# Altium schematic sheet LTE_power_Rev01.SchDoc
size Letter; SheetNumber: 4; SheetTotal: 6
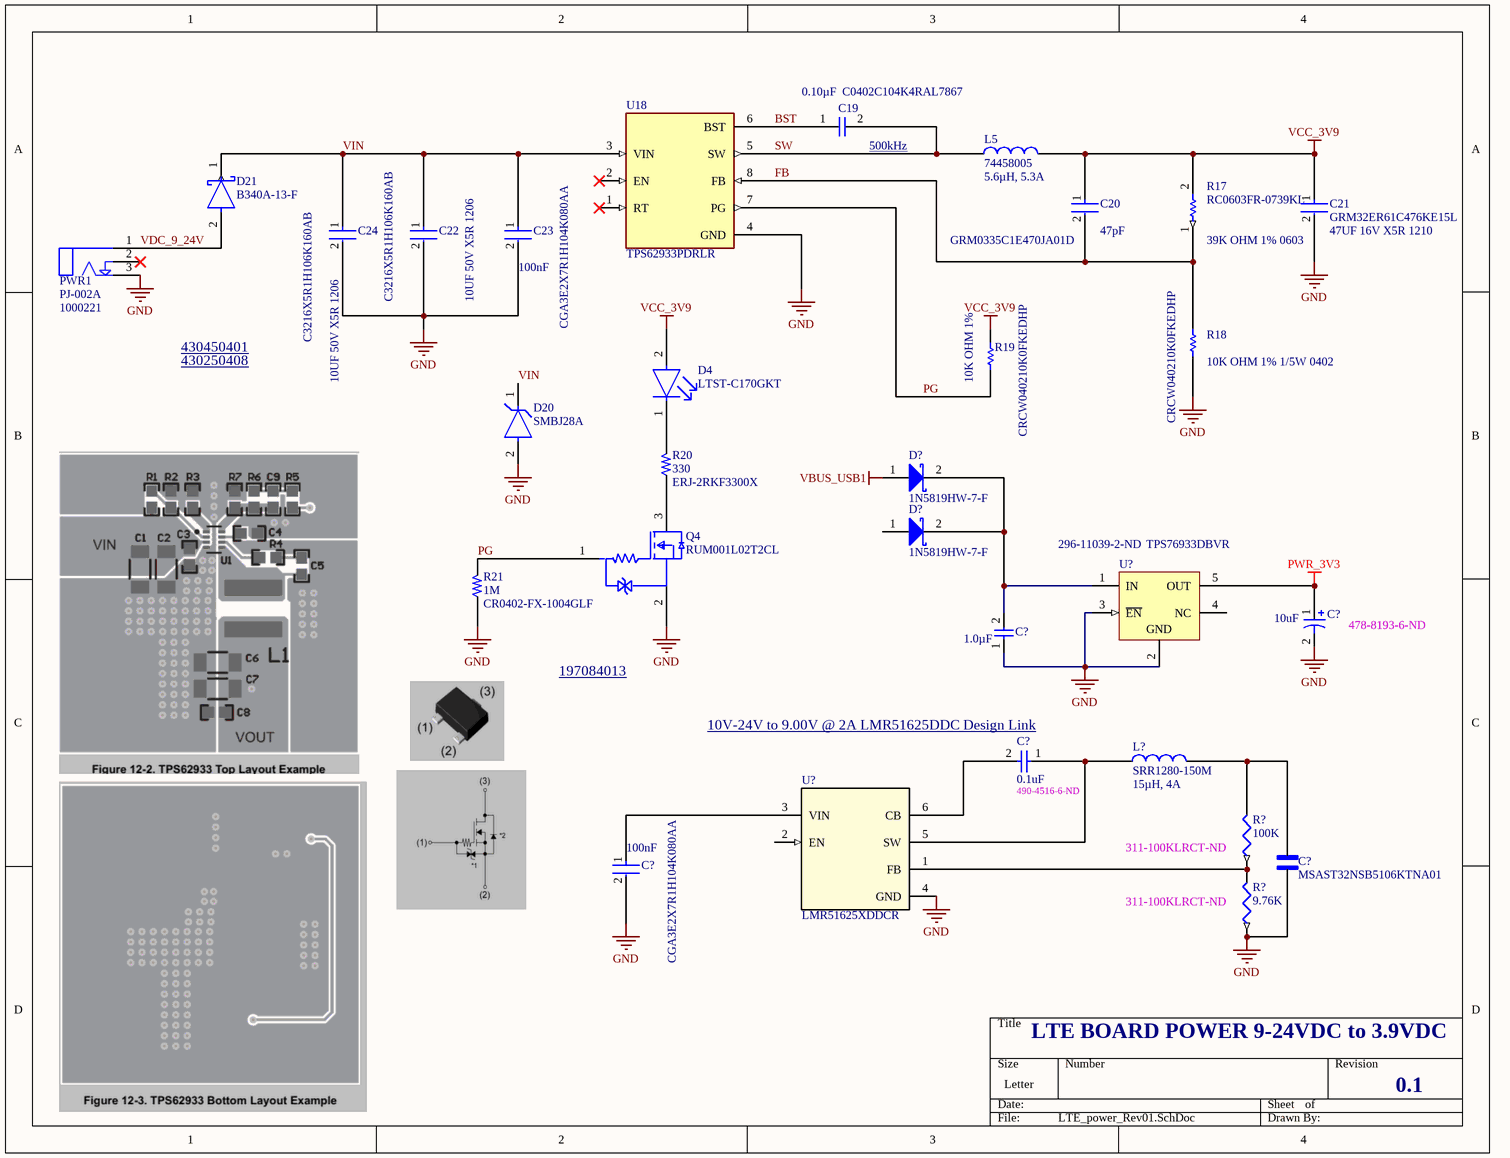
[diagram p0: LTE_power_Rev01.SchDoc]

## Parts
(Parts that share a designator on the sheet are numbered #1, #2 ... from top to bottom, then left to right.)
C19  C0402C104K4RAL7867  Capacitance: 0.10µF  [SMD CAP 1005]
C20  GRM0335C1E470JA01D  Capacitance: 47pF  [FP-GRM033-0_03-IPC_B]
C21  GRM32ER61C476KE15L  Capacitance: 47UF 16V X5R 1210  [FP-GRM32E-0_3-0_2-IPC_C]
C22  C3216X5R1H106K160AB  Capacitance: 10UF 50V X5R 1206  [FP-C3216-160-0_2-IPC_A]
C23  CGA3E2X7R1H104K080AA  Capacitance: 100nF  [FP-CGA3E-0_3-0_1-IPC_A]
C24  C3216X5R1H106K160AB  Capacitance: 10UF 50V X5R 1206  [FP-C3216-160-0_2-IPC_A]
C?#1  value 10uF  Supplier Part Number 2: 478-8193-6-ND  [TC3216-1206]  (hidden comment: F931A106MAA)
C?#2  value 1.0µF  [SMD CAP 1005]  (hidden comment: GRM155R61A105KE15D)
C?#3  Capacitance: 0.1uF  Supplier Part Number 1: 490-4516-6-ND  [SMD CAP 1005]  (hidden comment: GRM155R71H103KA88D)
C?#4  CGA3E2X7R1H104K080AA  Capacitance: 100nF  [FP-CGA3E-0_3-0_1-IPC_A]
C?#5  MSAST32NSB5106KTNA01  [CAPC3225X210N]
D4  LTST-C170GKT  [FP-LTST-C170GKT-MFG]
D20  SMBJ28A  [FP-SMBJ-MFG]
D21  B340A-13-F  [FP-SMA-MFG]
D?#1  1N5819HW-7-F  [DIOD-SOD-123-2_V]
D?#2  1N5819HW-7-F  [DIOD-SOD-123-2_V]
L5  5.6µH, 5.3A  [WE-PD4_Type X]
L?  value 15µH, 4A  [IND_BOURNS_SRR1280]  (hidden comment: SRR1280-150M)
PWR1  Manufacturer_Part_Number1: PJ-002A  Part_Number: 1000221  [PJ-202AH]  (hidden comment: PJ-202A)
Q4  RUM001L02T2CL  [FP-VMT3-MFG]
R17  RC0603FR-0739KL  Resistance: 39K OHM 1% 0603  [RESC1608X55X25LL10T15]
R18  CRCW040210K0FKEDHP  Resistance: 10K OHM 1% 1/5W 0402  [RESC1005X40X25ML05T10]
R19  CRCW040210K0FKEDHP  Resistance: 10K OHM 1%  [RESC1005X40X25ML05T10]
R20  Resistance: 330  [SMD RES 1005]  (hidden comment: ERJ-2RKF3300X)
R21  Resistance: 1M  [SMD RES 1005]  (hidden comment: CR0402-FX-1004GLF)
R?#1  value 100K  Supplier Part Number 1: 311-100KLRCT-ND  [SMD RES 1005]  (hidden comment: RC0402FR-07100KL)
R?#2  value 9.76K  Supplier Part Number 1: 311-100KLRCT-ND  [SMD RES 1005]  (hidden comment: RMCF0402FT9K76)
U18  TPS62933PDRLR  [SOFL50P160X60-8N]
U?#1  TPS76933DBVR  Supplier Part Number 1: 296-11039-2-ND  [DBV0005A_L]
U?#2  LMR51625XDDCR  [DDC0006A-MFG]

## Nets
GND: C21.2 C22.2 C23.2 C24.2 C?#1.2 C?#2.1 C?#4.2 C?#5.1 D20.2(A) PWR1.3 Q4.2(Source) R18.1 R21.1 R?#2.1 U18.4(GND) U?#1.2(GND) U?#1.3(~{EN}) U?#2.4(GND)
PWR_3V3: C?#1.1 U?#1.5(OUT)
VBUS_USB1: D?#1.1(A)
VCC_3V9: C20.1 C21.1 D4.2(A) L5.2 R17.2 R19.2
BST: C19.1 U18.6(BST)
FB: C20.2 R17.1 R18.2 U18.8(FB)
PG: Q4.1(Gate) R19.1 R21.2 U18.7(PG)
SW: C19.2 L5.1 U18.5(SW)
VDC_9_24V: D21.2(A) PWR1.1
VIN: C22.1 C23.1 C24.1 D20.1(C) D21.1(C) U18.3(VIN)
NetC?#2_2: C?#2.2 D?#1.2(K) D?#2.2(K) U?#1.1(IN)
NetC?#3_1: C?#3.1 L?.1 U?#2.5(SW)
NetC?#3_2: C?#3.2 U?#2.6(CB)
NetC?#4_1: C?#4.1 U?#2.3(VIN)
NetC?#5_2: C?#5.2 L?.2 R?#1.2
NetD4_1: D4.1(C) R20.2
NetQ4_3: Q4.3(Drain) R20.1
NetR?#1_1: R?#1.1 R?#2.2 U?#2.1(FB)

Not connected (* = marked no-connect by the designer): D?#2 1(A); PWR1 2*; U18 1(RT)* 2(EN)*; U?#1 4(NC); U?#2 2(EN)

## Notes on the sheet
- (near C19) 500kHz <https://www.mouser.com/ProductDetail/Molex/43030-0003-Cut-Strip?qs=Dbnw6jgPYP7YvqIV9njgyg%3D%3D>
- 9.3.3 Voltage Reference
  The internal reference voltage, VREF, is designed at 0.8 V (typical). The negative feedback system of converterproduces a precise ±2% feedback voltage, VFB, over full temperature by scaling the output of a temperaturestable internal band-gap circuit.
- (near U18) 9.3.8 Power Good
  The TPS62933P and TPS62933O have a built-in power good (PG) function to indicate whether the outputvoltage has reached its appropriate level or not. The PG signal can be used for start-up sequencing ofmultiple rails. The PG pin is an open-drain output that requires a pullup resistor to any voltage below 5.5 V.TI recommends a pullup resistor of 10 kΩ – 100 kΩ. The device can sink approximately 4 mA of current andmaintain its specified logic low level. After the FB pin voltage is between 90% and 110% of the internal referencevoltage (VREF) and after a deglitch time of 70 μs, the PG turns to high impedance status. The PG pin is pulledlow after a deglitch time of 18 μs when FB pin voltage is lower than 85% of the internal reference voltage orgreater than 115% of the internal reference voltage, or in events of thermal shutdown, EN shutdown, or UVLOconditions. VIN must remain present for the PG pin to stay low
- (near U18) 9.3.6 Enable and Adjusting Undervoltage Lockout
  The EN pin provides electrical ON and OFF control of the device. When the EN pin voltage exceeds the enablethreshold voltage, VEN_RISE, the TPS6293x begins operation. If the EN pin voltage is pulled below the disablethreshold voltage, VEN_FALL, the converter stops switching and enters shutdown mode.
  The EN pin has an internal pullup current source, which allows the user to float the EN pin to enable the device.If an application requires control of the EN pin, use an open-drain or open-collector or GPIO output logic tointerface with the pin
- (near L5) 9.3.4 Output Voltage Setting
  A precision 0.8-V reference voltage, VREF, is used to maintain a tightly regulated output voltage over the entireoperating temperature range. The output voltage is set by a resistor divider from the output voltage to the FBpin. TI recommends using 1% tolerance resistors with a low temperature coefficient for the FB divider. Select thebottom-side resistor, RFBB, for the desired divider current and use Equation 1 to calculate the top-side resistor,RFBT. Lower RFBB increases the divider current and reduces efficiency at very light load. Larger RFBB makes theFB voltage more susceptible to noise, so larger RFBB values require a more carefully designed feedback path onthe PCB. Setting RFBB = 10 kΩ and RFBT in the range of 10 kΩ to 300 kΩ is recommended for most applications.The tolerance and temperature variation of the resistor dividers affect the output voltage regulation
- (near C21) Skywire modems have a recommended input voltage of 3.90V. This recommendedinput voltage is chosen as the optimal input voltage to maximize power efficiency of themodem’s internal power systems. While the modems do support a fairly wide inputvoltage range, it is recommended to power the modems off of 3.90V as any deviationsoutside of the modem’s acceptable operating voltage range may irreparably damage themodem and void the warranty
- 430450401 <https://www.molex.com/molex/products/part-detail/pcb_headers/0430450401>
- 430250408 <https://www.molex.com/molex/products/part-detail/crimp_housings/0430250408>
- (near U18) The switching frequency can be set by the configuration of the RT pin in the range of 200 kHz to 2.2 MHz, whichallows for efficiency and solution size optimization when selecting the output filter components. The TPS62932,TPS62933, TPS62933P, and TPS62933O also have a frequency spread spectrum feature, which helps withlowering down EMI noise.
- (near U18) 9.3.5 Switching Frequency Selection
  The switching frequency is set by the condition of the RT input. The condition of this input is detected when thedevice is first enabled. Once the converter is running, the switching frequency selection is fixed and cannot bechanged until the next power-on cycle or EN toggle. Table 9-1 shows the selection programming. In adjustablefrequency mode, the switching frequency can be set between 200 kHz and 2200 kHz by proper selection of RTresistor.
  Floating > 280 kΩ 500 kHz
- 9.3.8 Power Good
  The TPS62933P and TPS62933O have a built-in power good (PG) function to indicate whether the outputvoltage has reached its appropriate level or not. The PG signal can be used for start-up sequencing ofmultiple rails. The PG pin is an open-drain output that requires a pullup resistor to any voltage below 5.5 V.TI recommends a pullup resistor of 10 kΩ – 100 kΩ. The device can sink approximately 4 mA of current andmaintain its specified logic low level. After the FB pin voltage is between 90% and 110% of the internal referencevoltage (VREF) and after a deglitch time of 70 μs, the PG turns to high impedance status. The PG pin is pulledlow after a deglitch time of 18 μs when FB pin voltage is lower than 85% of the internal reference voltage orgreater than 115% of the internal reference voltage, or in events of thermal shutdown, EN shutdown, or UVLOconditions. VIN must remain present for the PG pin to stay low.
- TPS62933P and TPS62933O open-drain power good indicator, which is asserted low ifoutput voltage is out of PG threshold, overvoltage, or if the device is under thermalshutdown, EN shutdown, or during soft start.
- 197084013 <https://www.molex.com/molex/products/part-detail/quick_disconnects/0197084013>
- (near C?#3) 10V-24V to 9.00V @ 2A LMR51625DDC Design Link <https://webench.ti.com/power-designer/switching-regulator/export/12>
- LTE BOARD POWER 9-24VDC to 3.9VDC
- 0.1

## Library data of the parts
C19 = 1000742: 0.1 µF ±10% 16V Ceramic Capacitor X7R 0402 (1005 Metric); Manufacturer1: Kemet; Manufacturer_Part_Number1: C0402C104K4RALTU; Item_Phase: Production; Mounting_Type: Surface Mount; Operating_Temperature: -55°C ~ 125°C; Thickness_Max: 0.022" (0.55mm); Value: 0.1uF; Tolerance: ±10%; Applications: General Purpose; Population: *; Part_Number: 1000742; Part_Type: Capacitor; Revision: A; Distributor1: Digi-Key; Distributor_Part_Number1: 399-6342-1-ND; Specs_View: https://app.bom.com/a/YGZ57I1I1KJQDBOE?v=spec.summary; Bom_View: https://app.bom.com/a/YGZ57I1I1KJQDBOE?v=bom.indented; Sourcing_View: https://app.bom.com/a/YGZ57I1I1KJQDBOE?v=sourcing.relationships; Costing_View: https://app.bom.com/a/YGZ57I1I1KJQDBOE?v=costing.summary; Files_View: https://app.bom.com/a/YGZ57I1I1KJQDBOE?v=files.associations; Datasheet_Link: http://www.samsungsem.com/kr/support/product-search/mlcc/CL05B104KO5NNNC.jsp; Capacitor_Type: Ceramic; Package_Case: 0402 (1005 Metric); Size_Dimension: 0.039" L x 0.020" W (1.00mm x 0.50mm); Temperature_Coefficient: X7R; Voltage_Rating: 16V; Distributor2: Digi-Key; Distributor_Part_Number2: 1276-1001-1-ND; Manufacturer2: Samsung Electro-Mechanics America, Inc; Manufacturer_Part_Number2: CL05B104KO5NNNC; Digi-Key Part Number: 399-C0402C104K4RAL7867CT-ND; Manufacturer: KEMET; Manufacturer Product Number: C0402C104K4RAL7867
C20 = CMP-2010-00985-2: 47 pF ±5% 25V Ceramic Capacitor C0G, NP0 0201 (0603 Metric); Manufacturer: Murata Electronics; Tolerance: 5%; Case Code (Imperial): 0201; Mount: Surface Mount; Voltage Rating: 25V; Depth: 0.3mm; Termination: SMD/SMT; Length: 0.024inch; Lead Free: Lead Free; Thickness: 0.013inch; Dielectric: C0G; Voltage Rating (DC): 25V; Case Code (Metric): 0603; Case/Package: 0201; Max Operating Temperature: 125°C; REACH SVHC: No SVHC; Package Quantity: 15000; Min Operating Temperature: -55°C; Packaging: Tape and Reel; Width: 0.012inch; Digi-Key Part Number: 490-1256-1-ND; Manufacturer Product Number: GRM0335C1E470JA01D
C21 = CMP-2000-06362-2: 47 µF ±10% 16V Ceramic Capacitor X5R 1210 (3225 Metric); Manufacturer: Murata Electronics; Case Code (Metric): 3225; RoHS Compliant: Yes; Min Operating Temperature: -55°C; Radiation Hardening: No; Voltage: 16V; Package Quantity: 1; Case Code (Imperial): 1210; Tolerance: 10%; REACH SVHC: No SVHC; Voltage Rating (DC): 16V; Dielectric: X5R; Case/Package: 1210; Length: 3.2mm; Voltage Rating: 16V; Packaging: Cut Tape; Width: 0.098inch; Number of Pins: 2; Lead Free: Lead Free; Height: 2.5mm; Material: Ceramic; Mount: Surface Mount; Termination: SMD/SMT; Max Operating Temperature: 85°C; Thickness: 0.106inch; Depth: 2.5mm; Digi-Key Part Number: 490-6539-1-ND; Manufacturer Product Number: GRM32ER61C476KE15L
C22 C24 = CMP-2000-06045-2: 10 µF ±10% 50V Ceramic Capacitor X5R 1206 (3216 Metric); Manufacturer: TDK Corporation; Min Operating Temperature: -55°C; Weight: 0.000571oz; Tolerance: 10%; Lead Free: Lead Free; REACH SVHC: No SVHC; Dielectric Material: Ceramic; Termination: SMD/SMT; Radiation Hardening: No; Case Code (Metric): 3216; Max Operating Temperature: 85°C; Voltage Rating (DC): 50V; Packaging: Tape and Reel; Height: 1.6mm; Voltage: 50V; Dielectric: X5R; Mount: Surface Mount; Voltage Rating: 50V; Length: 3.2mm; RoHS Compliant: Yes; Thickness: 0.071inch; Depth: 1.6mm; Width: 0.063inch; Case/Package: 1206; Series: C; Package Quantity: 1; Resistor Type: Ceramic; Case Code (Imperial): 1206; Construction: Flat; Digi-Key Part Number: 445-5998-1-ND; Manufacturer Product Number: C3216X5R1H106K160AB
C23 C?#4 = CMP-2000-07546-2: 0.1 µF ±10% 50V Ceramic Capacitor X7R 0603 (1608 Metric); Manufacturer: TDK Corporation; Weight: 7.1E-05oz; Composition: Ceramic; Max Operating Temperature: 125°C; Termination: SMD/SMT; Dielectric: X7R; Length: 1.6mm; Package Quantity: 1; REACH SVHC: No SVHC; Lead Free: Lead Free; Case Code (Metric): 1608; Min Operating Temperature: -55°C; Packaging: Tape and Reel; Tolerance: 10%; Voltage Rating: 50V; Case Code (Imperial): 0603; Case/Package: 0603; Voltage Rating (DC): 50V; Depth: 0.8mm; Radiation Hardening: No; Ratings: AEC-Q200; Mount: Surface Mount; Voltage: 50V; Thickness: 0.035inch; Width: 0.8mm; Height: 0.8mm; Digi-Key Part Number: 445-5666-1-ND; Manufacturer Product Number: CGA3E2X7R1H104K080AA
C?#1 = Cap Pol1: CAP TANT 10UF 10V 20% 1206; Manufacturer: AVX Corporation; Published: 8-Jun-2000; LatestRevisionDate: 17-Jul-2002; LatestRevisionNote: Re-released for DXP Platform.; PackageReference: RB7.6-15; Publisher: Altium Limited; PackageDescription: Polarized Capacitor (Radial); 2 Leads; Footprint: 1206 (3216 Metric); Digi-Key Part Number: 478-8193-1-ND; Manufacturer Part Number: F931A106MAA; Cost: 0.09660; Supplier 1: Mouser; Supplier 2: Digi-Key
C?#2 = C0603-1µ0: CAP CER 1UF 10V 10% X5R 0402; Manufacturer: Murata Electronics North America; Artikkelnr Noca: 20039205; Part Number: C0603-1µ0; Manufacturer Part Number: GRM155R61A105KE15D; Datasheet: *; Footprint: 0603; LatestRevisionDate: 2009-11-23; Pin Count: 2; Publisher: Nordic Semiconductor; Published: 2009-05-08; Supplier: *; Supplier part number: *; 2nd source Supplier: *; 2nd source part number: *; Digi-Key Part Number: 490-3890-1-ND; Note: *
C?#3 = Cap Semi: 0.1 µF ±10% 16V Ceramic Capacitor X7R 0402 (1005 Metric); Manufacturer: Murata Electronics; Manufacturer Product Number: GRM155R71C104KA88D; PackageReference: 0402; PackageDescription: Chip Capacitor; Digi-Key Part Number: 490-3261-1-ND; Footprint: 0402 (1005 Metric); Cost: 0.02558; Supplier 1: Digi-Key
C?#5 = MSAST32NSB5106KTNA01: MF: {'manufacturer': u'Taiyo Yuden'}; Package: None; Price: None; Value: *; MP: MSAST32NSB5106KTNA01; Availability: Unavailable
D4 = CMP-1674-00002-6: Green 569nm LED Indication - Discrete 2.1V 0805 (2012 Metric); Manufacturer: Lite-On Inc.; Lens Style: Diffused; Number of Elements: 1; Wavelength: 565nm; Luminous Intensity: 6mcd; Test Current: 10mA; Power Dissipation: 100mW; Reverse Voltage: 5V; Forward Current: 30mA; Lens Transparency: Clear; Viewing Angle: 130°; Lens Color: Colorless; Min Operating Temperature: -55°C; Dominant Wavelength: 569nm; Number of Pins: 2; Max Operating Temperature: 85°C; Forward Voltage: 2.1V; Color: Green; Radiation Hardening: No; Illumination Color: Green; Case Code (Metric): 2012; Case/Package: 0805; Width: 1.25mm; Case Code (Imperial): 0805; Package Quantity: 1; Height: 1.1mm; Depth: 1.25mm; Length: 2mm; Power Rating: 100mW; Lead Free: Lead Free; Number of LEDs: 1; Packaging: Tape and Reel; Mount: Surface Mount; Voltage: 5V; Digi-Key Part Number: 160-1179-1-ND; Manufacturer Product Number: LTST-C170GKT; Value: LED
D20 = CMP-08607-000081-1: 45.4V Clamp 13.3A Ipp Tvs Diode Surface Mount DO-214AA (SMBJ); Manufacturer: Littelfuse Inc.; Breakdown Voltage: 31.1V; Reverse Standoff Voltage: 28V; Direction: Unidirectional; Number Of Channels: 1; Peak Pulse Power: 600W; Max Junction Temp: +150°C; Value: TVS Voltage - Reverse Standoff (Typ) 28V  Voltage - Breakdown (Min) 31V; Temperature: -65°C to +150°C; Category: Diode; RoHS: TRUE; Height: 2.61mm; Device Class L1: Circuit Protection; Temperature Range Low: -65°C; ComponentLink2Description: Datasheet; Digikey Description: TVS DIODE 28V 45.4V DO214AA; Automotive: No; Package: SMBJ; Mouser Description: Littelfuse SMBJ28A, Uni-Directional TVS Diode, 600W, 2-Pin DO-214AA; ComponentLink2URL: https://www.littelfuse.com/~/media/electronics/datasheets/tvs_diodes/littelfuse_tvs_diode_smbj_datasheet.pdf.pdf; Manufacturer Part Number: SMBJ28A; Octopart: https://octopart.com/smbj28a-littelfuse-350790; Clamping Voltage: 45.4V; Peak Pulse Current: 13.3A; Temperature Range High: +150°C; Device Class L3: unset; Device Class L2: TVS Diodes; Lead Free: Yes; Digi-Key Part Number: SMBJ28ALFCT-ND; Manufacturer Product Number: SMBJ28A
D21 = CMP-1667-00003-3: Diode 40 V 3A Surface Mount SMA; Max Forward Surge Current (Ifsm): 80A; Voltage: 40V; Forward Voltage: 500mV; Polarity: Standard; Max Reverse Current: 500uA; Capacitance: 250pF; Element Configuration: Single; Mount: Surface Mount; Output Current: 3A; Radiation Hardening: No; Width: 2.92mm; Current Rating: 3A; Termination: SMD/SMT; Series: -; Max Operating Temperature: 125°C; Current: 3A; Max Repetitive Reverse Voltage (Vrrm): 40V; Min Operating Temperature: -55°C; REACH SVHC: No SVHC; Number of Pins: 2; Average Rectified Current: 3A; Contact Plating: Tin; RoHS Compliant: Yes; Max Reverse Voltage (DC): 40V; Packaging: Tape and Reel; Height: 2.3mm; Length: 4.6mm; Case/Package: SMA; Weight: 0.002258oz; Peak Non-Repetitive Surge Current: 80A; Package Quantity: 5000; Lead Free: Lead Free; Forward Current: 3A; Voltage Rating (DC): 40V; Digi-Key Part Number: B340A-FDICT-ND; Manufacturer Product Number: B340A-13-F
D?#1 D?#2 = CMP-0303-00003-1: DIODE SCHOTTKY 40V 1A SOD123; Manufacturer: Diodes Incorporated; @ VR (V): 40; @ Terminal Temperature TT (degC): 90; Maximum Average Rectified Current IO (A): 1; Total Capacitance CT (pF): 50; Peak Forward Surge Current IFSM (A): 25; Forward Voltage Drop VF (V): 0.45; Packing: Tape and Reel; VR (RMS) (V): 28; RoHS: TRUE; PartNumber: 1N5819HW-7-F; ComponentLink2URL: http://www.diodes.com/datasheets/ds30217.pdf; PackageDescription: 2-Pin SOD-123, Body 2.7 x 1.55 mm, Pitch 3.7 mm; @ IF (A): 1; Operating and Storage Temperature Range: -65 to 125 degC; ComponentLink1Description: Manufacturer URL; ComponentLink2Description: Datasheet; ComponentLink1URL: http://www.diodes.com/; Mounting Technology: Surface Mount; DatasheetVersion: Rev. 15-2; PackageReference: SOD-123-2; Maximum Reverse Current IR (uA): 50; Peak Repetitive Reverse Voltage VRRM (V): 40; Digi-Key Part Number: 1N5819HW-FDICT-ND; Manufacturer Part Number: 1N5819HW-7-F
L5 = 74458005: 5.6 µH Unshielded Drum Core, Wirewound Inductor 5.3 A 20mOhm Max Nonstandard / WE-PD4 SMT Power Inductor, Type X, 5.6µH, 5.3A, 0.02Ω; Manufacturer: Wurth Elektronik; Alternative Part Number: NPI52W5R6MTRF; Alternative Manufacture: NIC Components; Case/Size Code: Type X; DC Resistance: 0.012Ω; Saturation Current: 13.1A; Self Resonant Frequency: 26MHz; Manufacturer Part Number: 74458005; Category: Unshielded Power Inductors; Match Code: WE-PD4; ComponentLink1Description: Website Link; ComponentLink1URL: https://www.we-online.com/redexpert/article/74458005?ad; ComponentLink2Description: Datasheet Link; ComponentLink2URL: https://www.we-online.com/redexpert/spec/74458005?ad; Mount: Surface Mount; Operating Temperature Max: 125°C; Operating Temperature Min: -40°C; Packaging: Tape and Reel; Length: 18.5mm; Width: 15.2mm; Height: 7.1mm; DC Resistance Max: 0.02Ω; Inductance: 5.6µH; Rated Current: 5.3A; Digi-Key Part Number: 732-1380-1-ND; Manufacturer Product Number: 74458005; ComponentLink3Description: DigiKey Link; ComponentLink3URL: https://www.digikey.com/en/products/detail/w%C3%BCrth-elektronik/74458005/1638785?s=N4IgjCBcoMxgLFUBjKAzAhgGwM4FMAaEAeygG1x4YqA2EAXSIAcAXKEAZRYCcBLAOwDmIAL5EATAAYAHAHYkIVJEy5CJciACsAOhoACAK0AJBszaQQAVX68WAeTQBZPBhwBXbnlESZ0hUpV8IlJICh0YPQBBUxBWdmtbB2dXDy8xEABacX8oHjc1ELCGEXTs0JABABM3ZBZibmKgA; Value: 5.6µH, 5.3A; ComponentLink4Description: Datasheet; ComponentLink4URL: C:\Users\Roman.Chak\Documents\Projects\UVDI-360\Docs\Datasheets\Wurth Electronics\74458005.pdf
L? = 74458005: FIXED IND 15UH 5.2A 28.5MOHM SMD; Manufacturer: Bourns Inc.; Alternative Manufacture: NIC Components; Match Code: WE-PD4; Case/Size Code: Type X; Rated Current: 5.3A; Manufacturer Part Number: SRR1280-150M; Category: Unshielded Power Inductors; ComponentLink1Description: Website Link; ComponentLink1URL: https://www.we-online.com/redexpert/article/74458005?ad; ComponentLink2Description: Datasheet Link; ComponentLink2URL: https://www.we-online.com/redexpert/spec/74458005?ad; Mount: Surface Mount; Operating Temperature Max: 125°C; Operating Temperature Min: -40°C; Packaging: Cut Tape; DC Resistance: 28.5mOhm; DC Resistance Max: 28.5mOhm; Inductance: 15uH; Digi-Key Part Number: 732-1380-1-ND; ComponentLink3Description: DigiKey Link; ComponentLink3URL: https://www.digikey.com/en/products/detail/w%C3%BCrth-elektronik/74458005/1638785?s=N4IgjCBcoMxgLFUBjKAzAhgGwM4FMAaEAeygG1x4YqA2EAXSIAcAXKEAZRYCcBLAOwDmIAL5EATAAYAHAHYkIVJEy5CJciACsAOhoACAK0AJBszaQQAVX68WAeTQBZPBhwBXbnlESZ0hUpV8IlJICh0YPQBBUxBWdmtbB2dXDy8xEABacX8oHjc1ELCGEXTs0JABABM3ZBZibmKgA; ComponentLink4Description: Datasheet; ComponentLink4URL: C:\Users\Roman.Chak\Documents\Projects\UVDI-360\Docs\Datasheets\Wurth Electronics\74458005.pdf; DigiKey Part Number: SRR1280-150MCT-ND; Manufacturer Product Number: SRR1280-150M
PWR1 = 1000221: Power Barrel Connector Jack 2.10mm ID (0.083"), 5.50mm OD (0.217") Through Hole, Right Angle; Manufacturer1: CUI Inc; Manufacturer: Same Sky (Formerly CUI Devices); Item_Phase: Production; Contact_Type: Male Pin; Current_Rating: 2.5A; Gender: Male; Header_Orientation: Horizontal; Insertion_Removal_Method: Push In / Pull Out; Operating_Temperature: -25°C ~ 85°C; Voltage_Rating: 24VDC; Part_Type: Connector; Revision: B; Distributor1: Digi-Key; Distributor_Part_Number1: CP-002A-ND; Manufacturer2: CUI Inc; Manufacturer_Part_Number2: PJ-202A; Distributor2: Digi-Key; Distributor_Part_Number2: CP-202A-ND; Specs_View: https://app.bom.com/a/M4NTV6P6P87E101Q?v=spec.summary; Bom_View: https://app.bom.com/a/M4NTV6P6P87E101Q?v=bom.indented; Sourcing_View: https://app.bom.com/a/M4NTV6P6P87E101Q?v=sourcing.relationships; Costing_View: https://app.bom.com/a/M4NTV6P6P87E101Q?v=costing.summary; Files_View: https://app.bom.com/a/M4NTV6P6P87E101Q?v=files.associations; Color: Black; Connector_Type: Jack; Datasheet_Link: http://www.cui.com/product/resource/digikeypdf/pj-202a.pdf; Mounting_Type: Through Hole; Termination: Solder; DigiKey Part Number: CP-202AH-ND; Manufacturer Product Number: PJ-202AH
Q4 = RUM001L02T2CL: N-Channel 20 V 100mA (Ta) 150mW (Ta) Surface Mount VMT3; Manufacturer: Rohm Semiconductor; ComponentLink1Description: Datasheet; ComponentLink1URL: C:\Users\Roman.Chak\Documents\Projects\UVDI-360\Docs\Datasheets\MOSFET\rum001l02t2cl-e.pdf; Digi-Key Part Number: RUM001L02T2CLCT-ND; Manufacturer Product Number: RUM001L02T2CL
R17 = CMP-2000-06940-1: 39 kOhms ±1% 0.1W, 1/10W Chip Resistor 0603 (1608 Metric) Moisture Resistant Thick Film; Manufacturer: YAGEO; Voltage Rating: 50V; Power Rating: 100mW; Temperature Coefficient: 100PPM/C; Product: ThickFilmResistorsGeneralPurpose; Case Code - in: 0603; Tolerance: 1%; Operating Temperature Range: -55Cto+155C; Series: RC; Package Description: 2-Pin Surface Mount Device, Body 1.6 x 0.8 mm; Datasheet URL: http://www.yageo.com/documents/recent/PYu-RC_Group_51_RoHS_L_7.pdf; Package Reference: 0603; Case Code - mm: 1608; Datasheet Version: Rev. 7, 05/2017; Mounting Technology: SurfaceMount; Packaging: Reel; Manufacturer URL: http://www.yageo.com/; Termination Style: SMD/SMT; Digi-Key Part Number: 311-39.0KHRCT-ND; Manufacturer Product Number: RC0603FR-0739KL
R18 = CMP-2002-03043-1: 10 kOhms ±1% 0.2W, 1/5W Chip Resistor 0402 (1005 Metric) Automotive AEC-Q200, Pulse Withstanding Thick Film; Manufacturer: Vishay Dale; Value: 10K OHM 1% 1/5W 0402; Part Number: CRCW040210K0FKEDHP; Digi-Key Part Number: 541-10.0KYCT-ND; Manufacturer Product Number: CRCW040210K0FKEDHP
R19 = CMP-2002-03043-1: 10 kOhms ±1% 0.2W, 1/5W Chip Resistor 0402 (1005 Metric) Automotive AEC-Q200, Pulse Withstanding Thick Film; Manufacturer: Vishay Dale; Value: 10K OHM 1%; Part Number: CRCW040210K0FKEDHP; Digi-Key Part Number: 541-10.0KYCT-ND; Manufacturer Product Number: CRCW040210K0FKEDHP
R20 = 1001162: 330 Ohms ±1% 0.1W, 1/10W Chip Resistor 0402 (1005 Metric) Automotive AEC-Q200 Thick Film; Manufacturer1: Panasonic Electronic Components; Item_Phase: Production; Mounting_Type: Surface Mount; Number_of_Terminations: 2; Operating_Temperature: -55°C ~ 155°C; Temperature_Coefficient: ±100ppm/°C; Part_Number: 1001162; Part_Type: Resistor; Revision: A; Manufacturer_Part_Number1: ERJ-2RKF3300X; Distributor1: Digi-Key; Distributor_Part_Number1: P330LCT-ND; Specs_View: https://app.bom.com/a/1J28AL4L4NMTGF0H?v=spec.summary; Bom_View: https://app.bom.com/a/1J28AL4L4NMTGF0H?v=bom.indented; Sourcing_View: https://app.bom.com/a/1J28AL4L4NMTGF0H?v=sourcing.relationships; Costing_View: https://app.bom.com/a/1J28AL4L4NMTGF0H?v=costing.summary; Files_View: https://app.bom.com/a/1J28AL4L4NMTGF0H?v=files.associations; Composition: Thick Film; Datasheet_Link: http://industrial.panasonic.com/www-cgi/jvcr13pz.cgi?E+PZ+3+AOA0002+ERJ2RKF3300X+7+WW; Features: Automotive AEC-Q200; Height: 0.016" (0.40mm); Power: 0.1W, 1/10W; Resistor_Package: 0402 (1005 Metric); Size_Dimension: 0.039" L x 0.020" W (1.00mm x 0.50mm); Tolerance: ±1%; Digi-Key Part Number: P330LCT-ND; Manufacturer: Panasonic Electronic Components; Manufacturer Product Number: ERJ-2RKF3300X
R21 = 1000797: 1 MOhms ±1% 0.063W, 1/16W Chip Resistor 0402 (1005 Metric) Thick Film; Manufacturer1: Bourns Inc; Manufacturer: Bourns Inc.; Item_Phase: Production; Mounting_Type: Surface Mount; Number_of_Terminations: 2; Operating_Temperature: -55°C ~ 155°C; Temperature_Coefficient: ±100ppm/°C; Part_Number: 1000797; Part_Type: Resistor; Revision: A; Manufacturer_Part_Number1: CR0402-FX-1004GLF; Distributor1: Digi-Key; Distributor_Part_Number1: CR0402-FX-1004GLFTR-ND; Manufacturer2: Samsung Electro-Mechanics America, Inc; Manufacturer_Part_Number2: RC1005F105CS; Distributor2: Digi-Key; Distributor_Part_Number2: 1276-3433-2-ND; Specs_View: https://app.bom.com/a/R9SY0BUBUDCJ64DV?v=spec.summary; Bom_View: https://app.bom.com/a/R9SY0BUBUDCJ64DV?v=bom.indented; Sourcing_View: https://app.bom.com/a/R9SY0BUBUDCJ64DV?v=sourcing.relationships; Costing_View: https://app.bom.com/a/R9SY0BUBUDCJ64DV?v=costing.summary; Files_View: https://app.bom.com/a/R9SY0BUBUDCJ64DV?v=files.associations; Composition: Thick Film; Datasheet_Link: http://media.digikey.com/pdf/Data%20Sheets/Samsung%20PDFs/RC_Series_ds.pdf; Features: Moisture Resistant; Height: 0.016" (0.40mm); Power: 0.063W, 1/16W; Resistor_Package: 0402 (1005 Metric); Size_Dimension: 0.039" L x 0.020" W (1.00mm x 0.50mm); Tolerance: ±1%; Digi-Key Part Number: CR0402-FX-1004GLFCT-ND; Manufacturer Product Number: CR0402-FX-1004GLF
R?#1 = Res3: RES SMD 100K OHM 1% 1/16W 0402; Manufacturer: Yageo; Published: 8-Jun-2000; LatestRevisionDate: 29-May-2009; LatestRevisionNote: IPC-7351 Footprint Added.; PackageReference: J1-0603; Publisher: Altium Limited; PackageDescription: Chip Resistor; Digi-Key Part Number: 311-100KLRCT-ND; Manufacturer Part Number: RC0402FR-07100KL; Cost: 0.00242; Footprint: 0402 (1005 Metric); Supplier 1: Digi-Key
R?#2 = Res3: 9.76 kOhms ±1% 0.063W, 1/16W Chip Resistor 0402 (1005 Metric) Automotive AEC-Q200 Thick Film; Manufacturer: Stackpole Electronics Inc; Published: 8-Jun-2000; LatestRevisionDate: 29-May-2009; LatestRevisionNote: IPC-7351 Footprint Added.; PackageReference: J1-0603; Publisher: Altium Limited; PackageDescription: Chip Resistor; Digi-Key Part Number: RMCF0402FT9K76CT-ND; Manufacturer Part Number: RMCF0402FT9K76; Cost: 0.00242; Footprint: 0402 (1005 Metric); Supplier 1: Digi-Key
U18 = TPS62933PDRLR: Buck Switching Regulator IC Positive Adjustable 0.8V 1 Output 3A SOT-583; MF: Texas Instruments; MP: TPS62933PDRLR; Package: None; Availability: In Stock; Price: None; Purchase-URL: https://pricing.snapeda.com/search/part/TPS62933PDRLR/?ref=eda; Check_prices: https://www.snapeda.com/parts/TPS62933PDRLR/Texas+Instruments/view-part/?ref=eda; SnapEDA_Link: https://www.snapeda.com/parts/TPS62933PDRLR/Texas+Instruments/view-part/?ref=snap; Value: IC; Digi-Key Part Number: 296-TPS62933PDRLRCT-ND; Manufacturer: Texas Instruments; Manufacturer Product Number: TPS62933PDRLR; ComponentLink1Description: DigiKey link; ComponentLink1URL: https://www.digikey.com/en/products/detail/texas-instruments/TPS62933PDRLR/16669314?s=N4IgTCBcDaICoAUDKA2MBOAzJhIC6AvkA; ComponentLink2Description: Datasheet; ComponentLink2URL: C:\Users\Roman.Chak\Documents\Projects\UVDI-360\Docs\Datasheets\TI\tps62933f.pdf
U?#1 = CMP-0394-00574-2: LDO Voltage Regulators Ultra Low-Power 100-mA LDO; Manufacturer: Texas Instruments; Fixed Output Options(V): 3.3; Eco-Plan: Green (RoHS & no Sb/Br); Iq(Typ)(mA): 0.02; Rating: Catalog; Vin(Max)(V): 10; SubFamily: Single Channel LDO; Iout(Max)(A): 0.1; Vin(Min)(V): 2.7; Accuracy(%): 3; Vdo(Typ)(mV): 98; ComponentLink3Description: Package Specification; DatasheetVersion: SLVS203E; Mounting Technology: Surface Mount; PackageReference: DBV0005A; ComponentLink1URL: C:\Users\Roman\Documents\Projects\GalaS-NDT\Galas-HV-Det_Rev-00\Docs\Datasheets\TPS76933DBVR.pdf; Vout Adj(Max)(V): 3.3; ComponentLink1Description: C Datasheet; ComponentLink4Description: URL Link1; PartNumber: TPS76933DBVR; ComponentLink4URL: Samples URL:http://www.ti.com/product/tps76933#samples; ComponentLink3URL: http://www.ti.com/litv/pdf/mpds018i; Code_JEDEC: MO-178; ComponentLink2URL: https://www.ti.com/lit/ds/symlink/tps769.pdf?ts=1767553106927&ref_url=https%253A%252F%252Fwww.ti.com%252Fproduct%252FTPS769%253FkeyMatch%253DTPS76933DBVR%2526tisearch%253Duniversal_search%2526usecase%253DOPN-ALT; ComponentLink2Description: Datasheet; Vout Adj(Min)(V): 3.3; PackageDescription: 5-Pin Plastic Small Outline, Body 1.60 Ãƒâ€” 2.90 mm, Pitch 0.95 mm; PackageVersion: 4073253-4/K; Supplier 1: Digi-Key; Mouser #:: 595-TPS76933DBVR; Manufacturer Part Number: TPS76933DBVR; Parameter 1: *; ComponentLink5Description: Product Page; ComponentLink5URL: https://www.ti.com/product/TPS769?keyMatch=TPS76933DBVR&tisearch=universal_search&usecase=OPN-ALT
U?#2 = LMR51625XDDCR: SIMPLE SWITCHERÂ® synchronous buck converter with 4.3V-to-60V, 2.5A and low quiescent current 6-SOT-23-THIN -40 to 150; Manufacturer_Name: Texas Instruments; TYPE: TYPE; RefDes: RefDes; Copyright: Copyright (C) 2026 Ultra Librarian. All rights reserved.; Manufacturer_Part_Number: LMR51625XDDCR